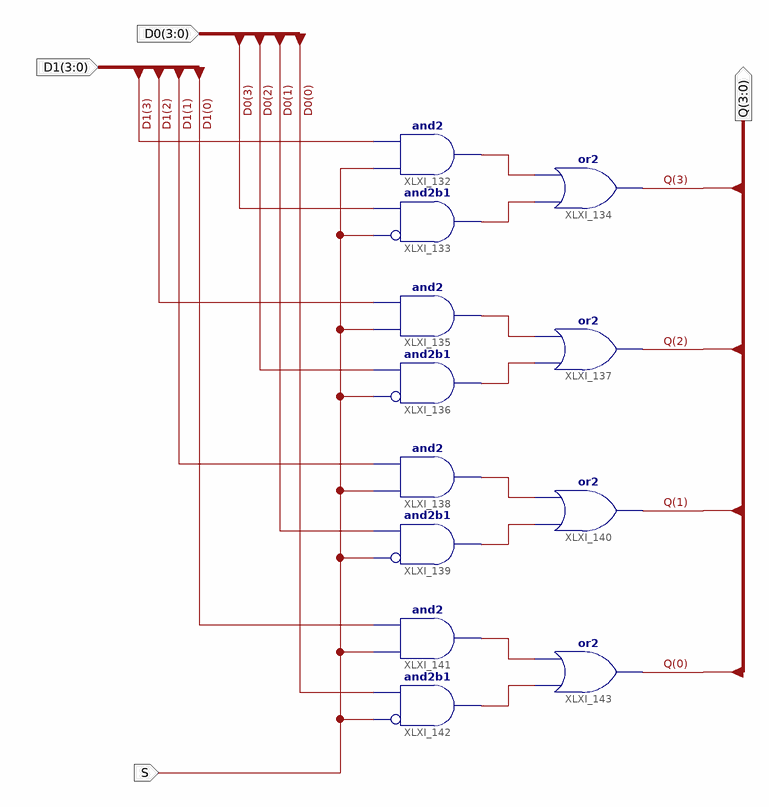
[diagram p0: schematic sheet 1]
// Xilinx ISE schematic mux2x1x4.sch (spartan6) as structural Verilog: 12 symbols, 4 ports
module mux2x1x4 (
  input  [3:0] D0,
  input  [3:0] D1,
  input  S,
  output [3:0] Q
);

  wire XLXN_150, XLXN_153, XLXN_154, XLXN_155, XLXN_156, XLXN_157, XLXN_158, XLXN_159;

  and XLXI_132 (XLXN_150, S, D1[3]);
  and XLXI_133 (XLXN_153, ~S, D0[3]);  // and2b1
  or XLXI_134 (Q[3], XLXN_153, XLXN_150);
  and XLXI_135 (XLXN_154, S, D1[2]);
  and XLXI_136 (XLXN_155, ~S, D0[2]);  // and2b1
  or XLXI_137 (Q[2], XLXN_155, XLXN_154);
  and XLXI_138 (XLXN_156, S, D1[1]);
  and XLXI_139 (XLXN_157, ~S, D0[1]);  // and2b1
  or XLXI_140 (Q[1], XLXN_157, XLXN_156);
  and XLXI_141 (XLXN_158, S, D1[0]);
  and XLXI_142 (XLXN_159, ~S, D0[0]);  // and2b1
  or XLXI_143 (Q[0], XLXN_159, XLXN_158);
endmodule
